# Altium schematic sheet 01-Cover.SchDoc: Cover Page
size A2; DocumentNumber: 1; SheetNumber: 1; SheetTotal: 15
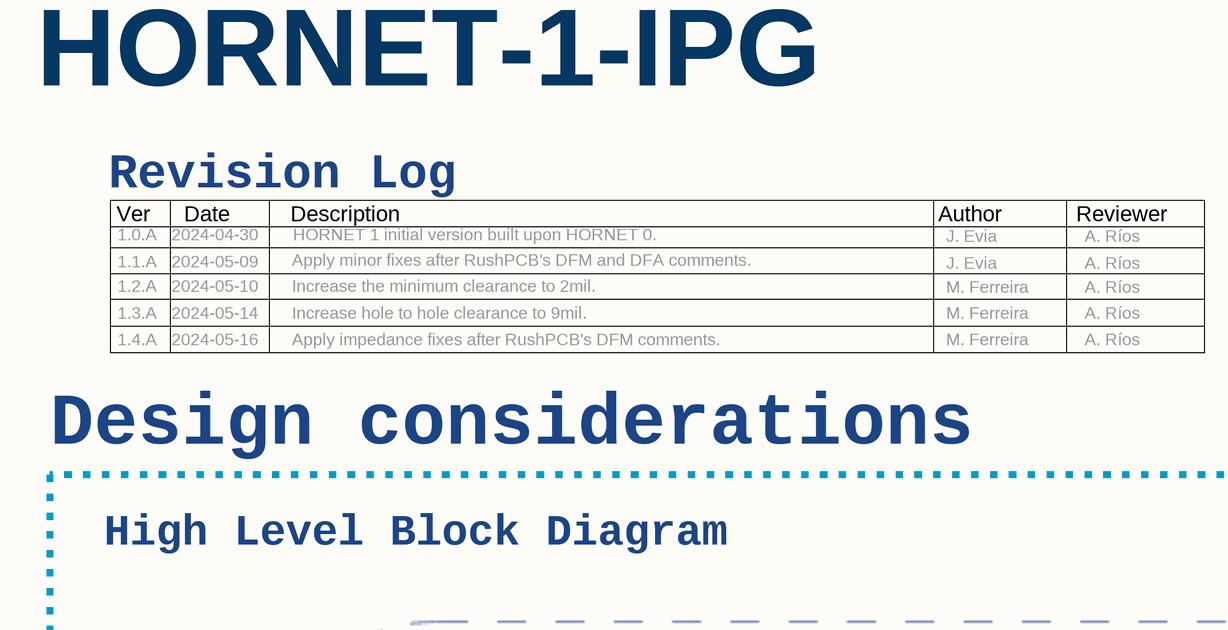
[diagram p0: 01-Cover.SchDoc, top left]
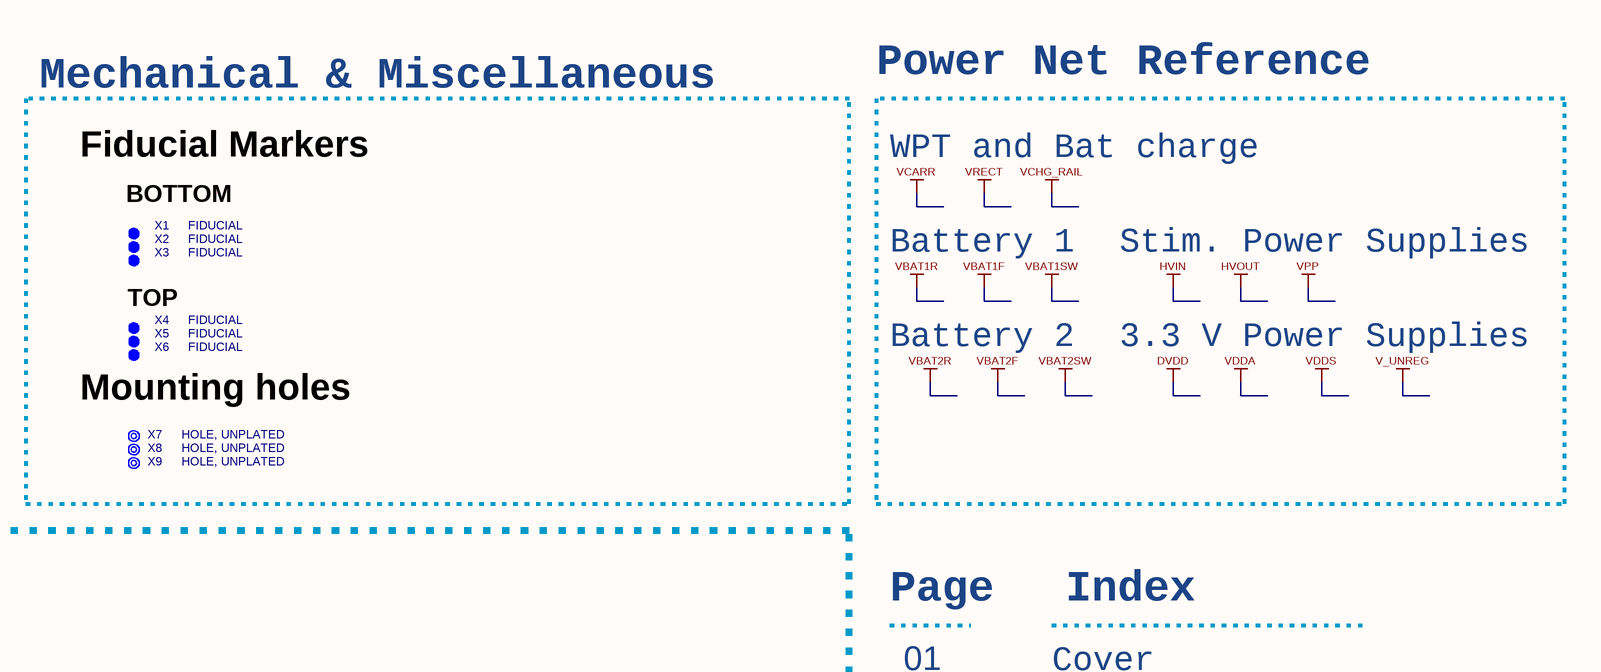
[diagram p1: 01-Cover.SchDoc, top right]
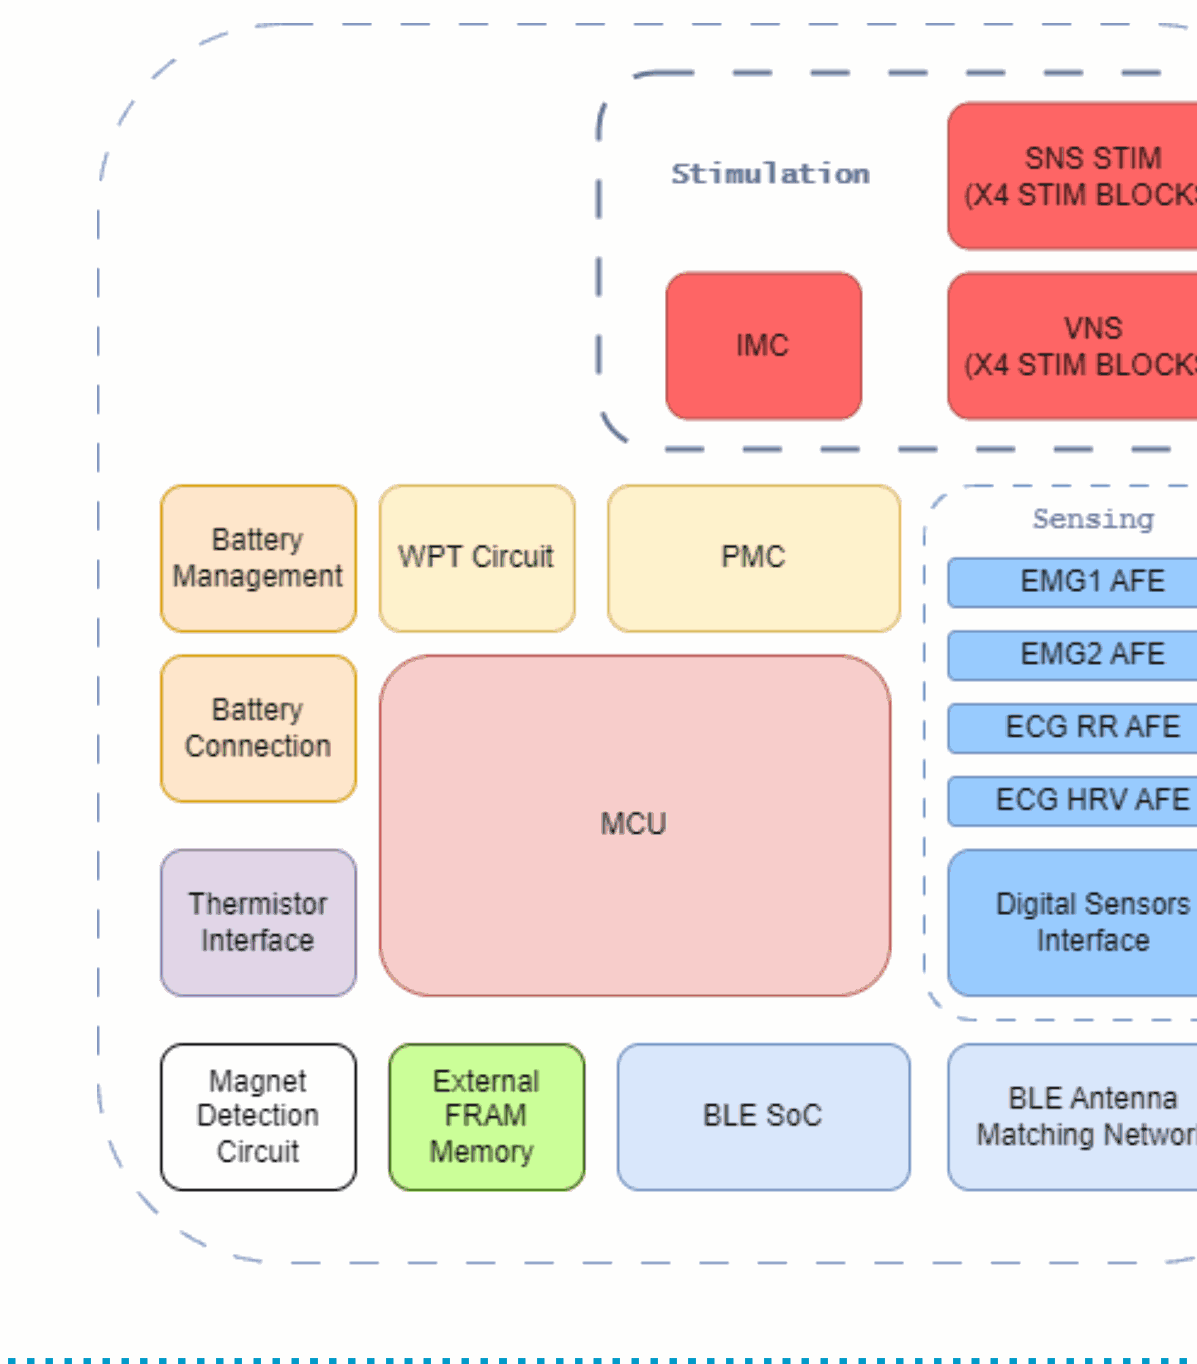
[diagram p2: 01-Cover.SchDoc, bottom left]
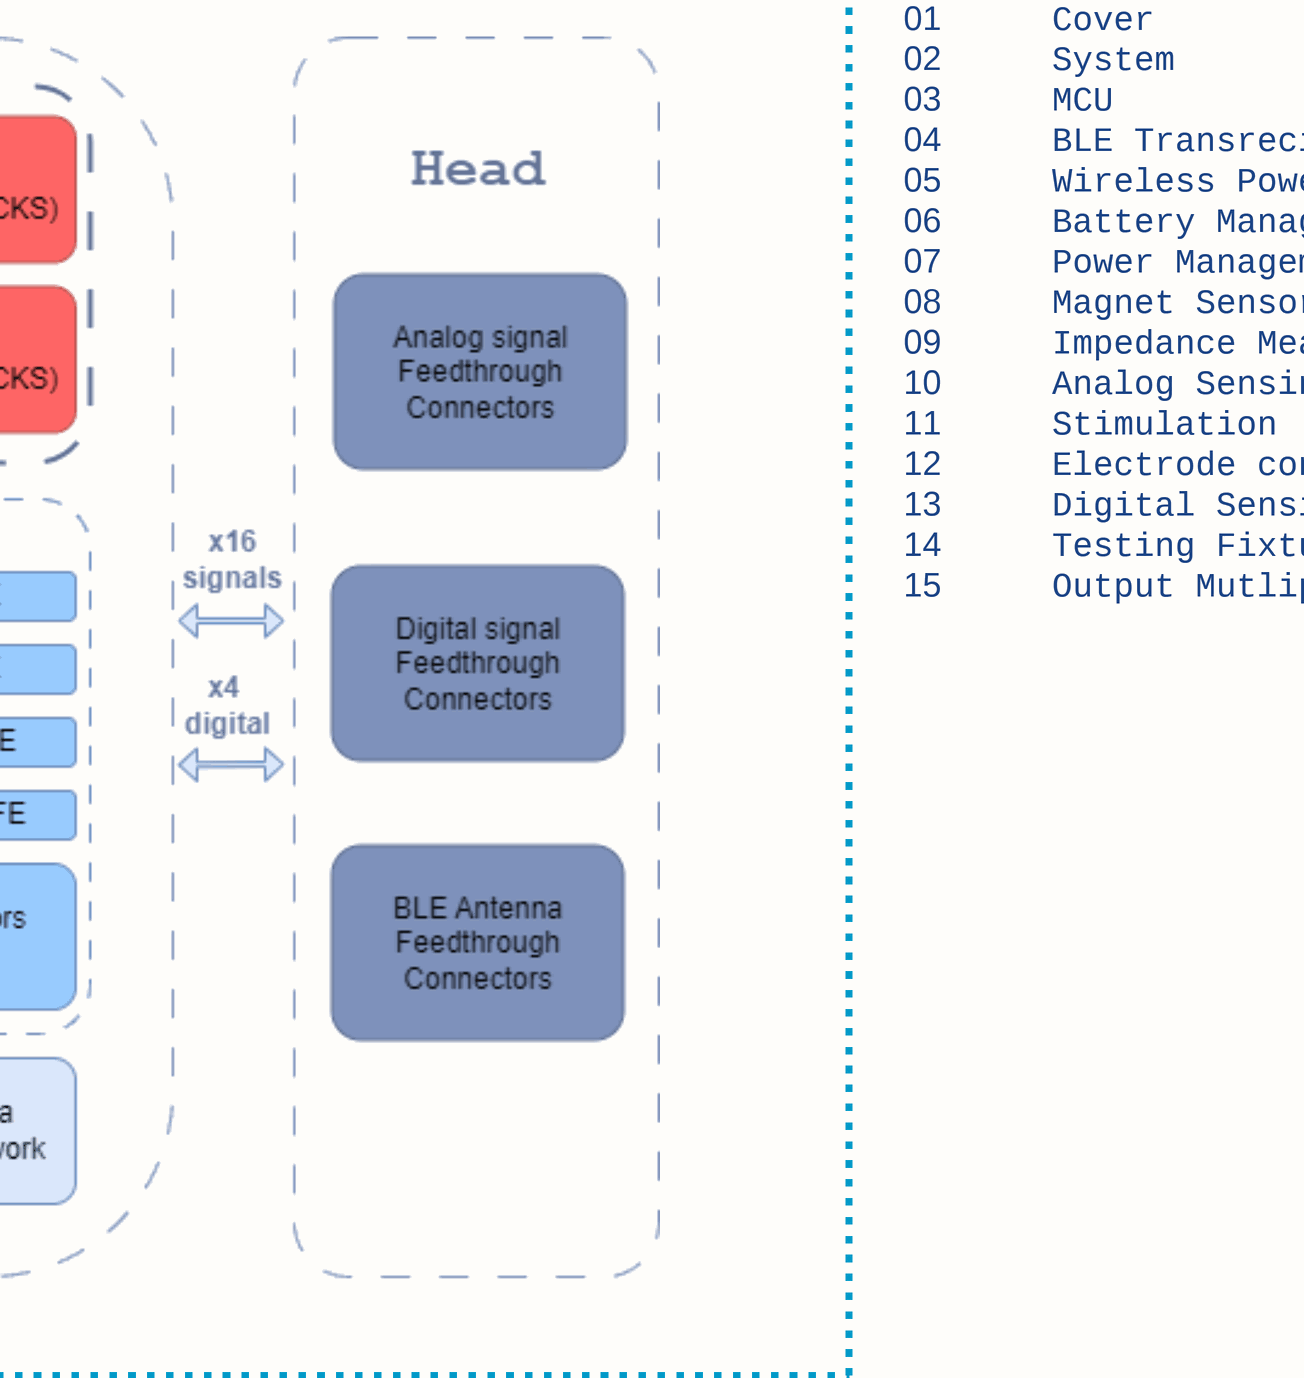
[diagram p3: 01-Cover.SchDoc, bottom right]

## Parts
X1  FIDUCIAL  [Fid_IPC-7351B]  (no BOM)
X2  FIDUCIAL  [Fid_IPC-7351B]  (no BOM)
X3  FIDUCIAL  [Fid_IPC-7351B]  (no BOM)
X4  FIDUCIAL  [Fid_IPC-7351B]  (no BOM)
X5  FIDUCIAL  [Fid_IPC-7351B]  (no BOM)
X6  FIDUCIAL  [Fid_IPC-7351B]  (no BOM)
X7  HOLE, UNPLATED  [HOLE_UNPLATED_3.5MM]  (no BOM)
X8  HOLE, UNPLATED  [HOLE_UNPLATED_3.5MM]  (no BOM)
X9  HOLE, UNPLATED  [HOLE_UNPLATED_3.5MM]  (no BOM)

## Sub-sheets
U_System = 02-System.SchDoc: no entries

## Notes on the sheet
- Power Net Reference
- Mechanical & Miscellaneous
- HORNET-1-IPG
- Fiducial Markers
- BOTTOM
- WPT and Bat charge
- Revision Log
- Ver
- Date
- Description
- Author
- Reviewer
- Battery 1
- Stim. Power Supplies
- 1.0.A
- 1.1.A
- 1.2.A
- 2024-04-30
- 2024-05-09
- 2024-05-10
- Apply minor fixes after RushPCB's DFM and DFA comments.
- Increase the minimum clearance to 2mil.
- HORNET 1 initial version built upon HORNET 0.
- J. Evia
- M. Ferreira
- A. Ríos
- TOP
- Battery 2
- 3.3 V Power Supplies
- 1.4.A
- 1.3.A
- 2024-05-16
- 2024-05-14
- Apply impedance fixes after RushPCB's DFM comments.
- Increase hole to hole clearance to 9mil.
- (near X6) Mounting holes
- Design considerations
- High Level Block Diagram
- Page
- Index
- 01
- Cover
- 02
- 03
- System
- MCU
- 04
- BLE Transreciver
- 05
- 06
- Wireless Power Transfer
- Battery Management
- 07
- 08
- Power Management
- Magnet Sensor
- 09
- Impedance Meas. circuit
- 10
- 11
- Analog Sensing
- Stimulation
- 12
- 13
- Electrode connections
- Digital Sensing
- 14
- Testing Fixture
- 15
- Output Mutliplexing
- Project:
- Schematic:
- Design by:
- Date:
- Ver:
- .
- Comments:
- Reviewed by:

## Library data of the parts
X1-X6 = FIDUCIAL: FIDUCIAL_MARK; Manufacturer PN: FIDUCIAL; Status: *; Review: *
X7-X9 = HOLE_UNPLATED: Status: *; Review: *